# Altium schematic sheet 05 - CONNECTOR.SchDoc
size A4; Date: 20/01/2025; SheetNumber: 5; SheetTotal: 5; Nome da Sheet: 06 - CONNECTOR; Data: 20/01/2025; Revisão: RV01B
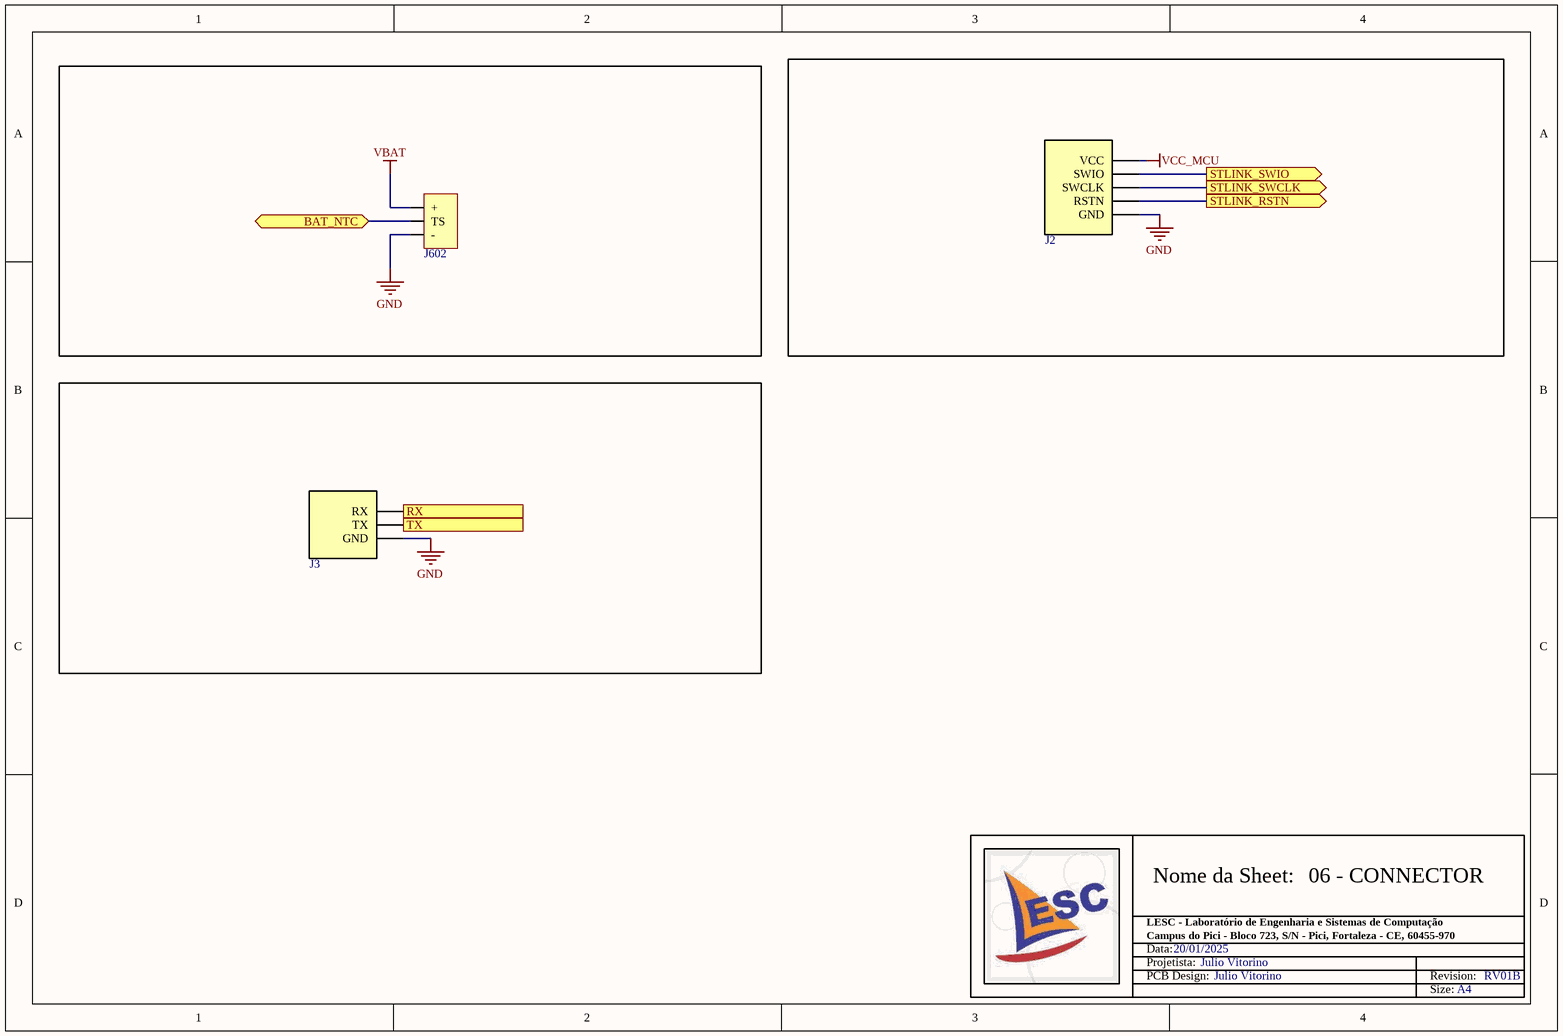
[diagram p0: 05 - CONNECTOR.SchDoc]

## Parts
J2  CONN PCB 5PIN  [SWD CONNECTOR]  (value not drawn)
J3  CONN PCB 3PIN  [DEBUG CONNECTOR]  (value not drawn)
J602  10114830-11103LF  [CONNECTOR BATTERY]  (value not drawn)

## Ports
BAT_NTC (bidir), RX (out), STLINK_RSTN (out), STLINK_SWCLK (out), STLINK_SWIO (out), TX (out)

## Nets
GND: J2.5(GND) J3.3(GND) J602.1(-)
VBAT: J602.3(+)
VCC_MCU: J2.1(VCC)
BAT_NTC: J602.2(TS) ; port BAT_NTC
RX: J3.1(RX) ; port RX
STLINK_RSTN: J2.4(RSTN) ; port STLINK_RSTN
STLINK_SWCLK: J2.3(SWCLK) ; port STLINK_SWCLK
STLINK_SWIO: J2.2(SWIO) ; port STLINK_SWIO
TX: J3.2(TX) ; port TX

## Notes on the sheet
- LESC - Laboratório de Engenharia e Sistemas de Computação
- Nome da Sheet:
- Data:
- Projetista:
- PCB Design:
- Campus do Pici - Bloco 723, S/N - Pici, Fortaleza - CE, 60455-970
- Julio Vitorino
- Revision:
- Size:
- A4

## Library data of the parts
J602 = CONN HEADER SMD R/A 3POS 1.25MM: Manufacturer: Amphenol ICC; eVendor Part#: 609-10114830-11103LFCT-ND; eVendor: Digikey; eVendor Price: 0,48; MSRP: 0,27254; PN: 10114830-11103LF; MOQ: 500; NP: *